# Altium schematic sheet vDAC2.SchDoc: Laser PCB
size A3; DrawnBy: James Singleton; Organization: TMC Technology Ltd.; DocumentNumber: 15; Revision: A; SheetNumber: 15; SheetTotal: 18; Drawn Date: 22/12/2020
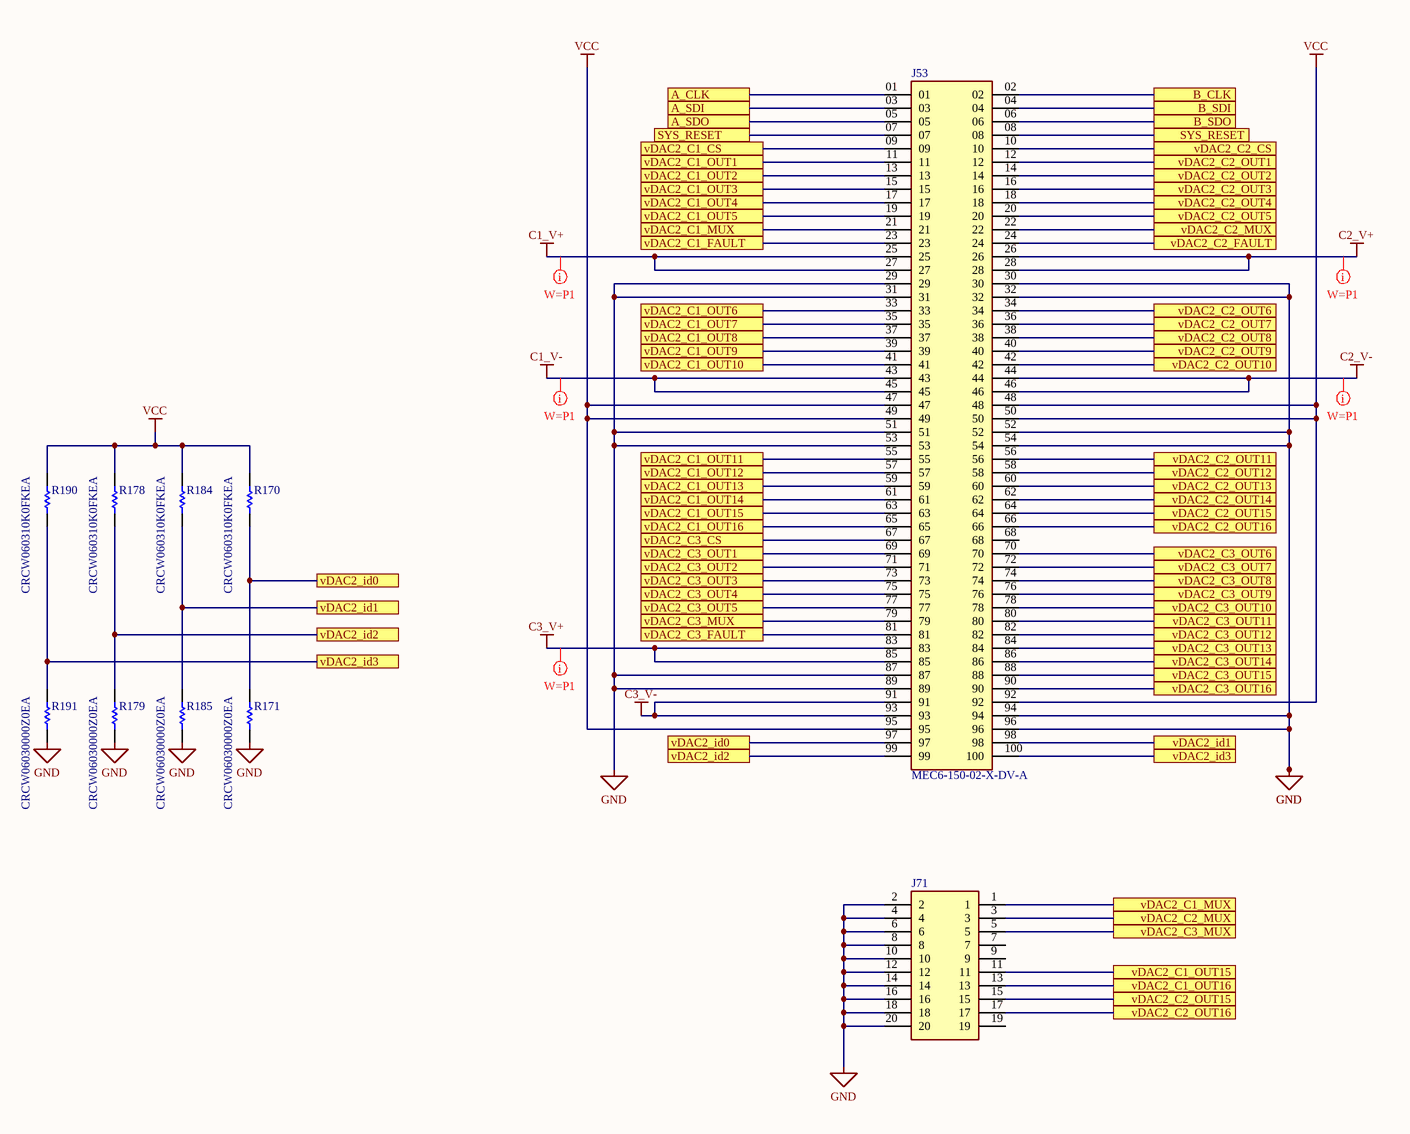
[diagram p0: vDAC2.SchDoc]

## Parts
J53  MEC6-150-02-X-DV-A  [SAMTEC_MEC6-150-02-X-DV-A]
J71  (no value)  [HDRV20W40P127_2X10_1270X340X550P]
R170  CRCW060310K0FKEA  [RESC1609X50X30NL8T20]
R171  CRCW06030000Z0EA  [RESC1609X50X30NL8T20]
R178  CRCW060310K0FKEA  [RESC1609X50X30NL8T20]
R179  CRCW06030000Z0EA  [RESC1609X50X30NL8T20]
R184  CRCW060310K0FKEA  [RESC1609X50X30NL8T20]
R185  CRCW06030000Z0EA  [RESC1609X50X30NL8T20]
R190  CRCW060310K0FKEA  [RESC1609X50X30NL8T20]
R191  CRCW06030000Z0EA  [RESC1609X50X30NL8T20]

## Ports
A_CLK (see iDAC1[4A], iDAC2[4A], PI_INTERFACE[2B], vDAC1[4A]), A_SDI (see iDAC1[4A], iDAC2[4A], PI_INTERFACE[2B], vDAC1[4A]), A_SDO (see iDAC1[4A], iDAC2[4A], PI_INTERFACE[1B], vDAC1[4A]), B_CLK (see iDAC1[6A], iDAC2[6A], PI_INTERFACE[2B], vDAC1[5A]), B_SDI (see iDAC1[6A], iDAC2[6A], PI_INTERFACE[2B], vDAC1[5A]), B_SDO (see iDAC1[6A], iDAC2[6A], PI_INTERFACE[1B], vDAC1[5A]), SYS_RESET (see iDAC1[4A], iDAC1[6A], iDAC2[4A], iDAC2[6A], PI_INTERFACE[1C], PIO[5A], PIO[5D], PIO[7B], PIO[7C], vDAC1[4A], vDAC1[5A], vDAC2[3A]), SYS_RESET (see iDAC1[4A], iDAC1[6A], iDAC2[4A], iDAC2[6A], PI_INTERFACE[1C], PIO[5A], PIO[5D], PIO[7B], PIO[7C], vDAC1[4A], vDAC1[5A], vDAC2[5A]), vDAC2_C1_CS (see ChipSelects+Faults[6A]), vDAC2_C1_FAULT (see ChipSelects+Faults[1A]), vDAC2_C1_MUX (see vDAC2[3B]), vDAC2_C1_MUX (see vDAC2[5C]), vDAC2_C1_OUT1 (see TX_FlexiConnectors[5A]), vDAC2_C1_OUT2 (see TX_FlexiConnectors[5A]), vDAC2_C1_OUT3 (see TX_FlexiConnectors[5A]), vDAC2_C1_OUT4 (see TX_FlexiConnectors[5A]), vDAC2_C1_OUT5 (see TX_FlexiConnectors[5A]), vDAC2_C1_OUT6 (see TX_FlexiConnectors[5B]), vDAC2_C1_OUT7 (see TX_FlexiConnectors[5B]), vDAC2_C1_OUT8 (see TX_FlexiConnectors[5B]), vDAC2_C1_OUT9 (see TX_FlexiConnectors[5B]), vDAC2_C1_OUT10 (see TX_FlexiConnectors[5B]), vDAC2_C1_OUT11 (see TX_FlexiConnectors[5B]), vDAC2_C1_OUT12 (see TX_FlexiConnectors[5B]), vDAC2_C1_OUT13 (see TX_FlexiConnectors[5C]), vDAC2_C1_OUT14 (see TX_FlexiConnectors[5C]), vDAC2_C1_OUT15 (see vDAC2[3B]), vDAC2_C1_OUT15 (see vDAC2[5D]), vDAC2_C1_OUT16 (see vDAC2[3B]), vDAC2_C1_OUT16 (see vDAC2[5D]), vDAC2_C2_CS (see ChipSelects+Faults[6A]), vDAC2_C2_FAULT (see ChipSelects+Faults[1A]), vDAC2_C2_MUX (see vDAC2[5B]), vDAC2_C2_MUX (see vDAC2[5C]), vDAC2_C2_OUT1 (see TX_FlexiConnectors[5A]), vDAC2_C2_OUT2 (see TX_FlexiConnectors[5A]), vDAC2_C2_OUT3 (see TX_FlexiConnectors[5A]), vDAC2_C2_OUT4 (see TX_FlexiConnectors[5A]), vDAC2_C2_OUT5 (see TX_FlexiConnectors[5B]), vDAC2_C2_OUT6 (see TX_FlexiConnectors[5B]), vDAC2_C2_OUT7 (see TX_FlexiConnectors[5B]), vDAC2_C2_OUT8 (see TX_FlexiConnectors[5B]), vDAC2_C2_OUT9 (see TX_FlexiConnectors[5B]), vDAC2_C2_OUT10 (see TX_FlexiConnectors[5B]), vDAC2_C2_OUT11 (see TX_FlexiConnectors[5B]), vDAC2_C2_OUT12 (see TX_FlexiConnectors[5B]), vDAC2_C2_OUT13 (see TX_FlexiConnectors[5C]), vDAC2_C2_OUT14 (see TX_FlexiConnectors[5C]), vDAC2_C2_OUT15 (see vDAC2[5B]), vDAC2_C2_OUT15 (see vDAC2[5D]), vDAC2_C2_OUT16 (see vDAC2[5B]), vDAC2_C2_OUT16 (see vDAC2[5D]), vDAC2_C3_CS (see ChipSelects+Faults[6A]), vDAC2_C3_FAULT (see ChipSelects+Faults[1A]), vDAC2_C3_MUX (see vDAC2[3C]), vDAC2_C3_MUX (see vDAC2[5D]), vDAC2_C3_OUT1 (see RX_FlexiConnectors[2B]), vDAC2_C3_OUT2 (see RX_FlexiConnectors[2B]), vDAC2_C3_OUT3 (see RX_FlexiConnectors[2B]), vDAC2_C3_OUT4 (see RX_FlexiConnectors[2B]), vDAC2_C3_OUT5 (see RX_FlexiConnectors[2B]), vDAC2_C3_OUT6 (see RX_FlexiConnectors[2B]), vDAC2_C3_OUT7 (see RX_FlexiConnectors[2B]), vDAC2_C3_OUT8 (see RX_FlexiConnectors[2B]), vDAC2_C3_OUT9 (see RX_FlexiConnectors[6B]), vDAC2_C3_OUT10 (see RX_FlexiConnectors[6B]), vDAC2_C3_OUT11 (see RX_FlexiConnectors[6B]), vDAC2_C3_OUT12 (see RX_FlexiConnectors[6B]), vDAC2_C3_OUT13 (see RX_FlexiConnectors[6B]), vDAC2_C3_OUT14 (see RX_FlexiConnectors[6B]), vDAC2_C3_OUT15 (see RX_FlexiConnectors[6B]), vDAC2_C3_OUT16 (see RX_FlexiConnectors[6B]), vDAC2_id0 (see ChipSelects+Faults[1C], vDAC2[2C]), vDAC2_id0 (see ChipSelects+Faults[1C], vDAC2[4C]), vDAC2_id1 (see vDAC2[2C]), vDAC2_id1 (see vDAC2[5C]), vDAC2_id2 (see vDAC2[2C]), vDAC2_id2 (see vDAC2[4C]), vDAC2_id3 (see vDAC2[2C]), vDAC2_id3 (see vDAC2[5C])

## Nets
C1_V+: J53.25 J53.27
C1_V-: J53.43 J53.45
C2_V+: J53.26 J53.28
C2_V-: J53.44 J53.46
C3_V+: J53.83 J53.85
C3_V-: J53.91 J53.93
GND: J53.29 J53.30 J53.31 J53.32 J53.51 J53.52 J53.53 J53.54 J53.87 J53.89 J53.94 J53.96 J71.2 J71.4 J71.6 J71.8 J71.10 J71.12 J71.14 J71.16 J71.18 J71.20 R171.1 R179.1 R185.1 R191.1
VCC: J53.47 J53.48 J53.49 J53.50 J53.92 J53.95 R170.2 R178.2 R184.2 R190.2
A_CLK: J53.01 ; port A_CLK
A_SDI: J53.03 ; port A_SDI
A_SDO: J53.05 ; port A_SDO
B_CLK: J53.02 ; port B_CLK
B_SDI: J53.04 ; port B_SDI
B_SDO: J53.06 ; port B_SDO
SYS_RESET: J53.07 J53.08 ; port SYS_RESET
vDAC2_C1_CS: J53.09 ; port vDAC2_C1_CS
vDAC2_C1_FAULT: J53.23 ; port vDAC2_C1_FAULT
vDAC2_C1_MUX: J53.21 J71.1 ; port vDAC2_C1_MUX
vDAC2_C1_OUT1: J53.11 ; port vDAC2_C1_OUT1
vDAC2_C1_OUT2: J53.13 ; port vDAC2_C1_OUT2
vDAC2_C1_OUT3: J53.15 ; port vDAC2_C1_OUT3
vDAC2_C1_OUT4: J53.17 ; port vDAC2_C1_OUT4
vDAC2_C1_OUT5: J53.19 ; port vDAC2_C1_OUT5
vDAC2_C1_OUT6: J53.33 ; port vDAC2_C1_OUT6
vDAC2_C1_OUT7: J53.35 ; port vDAC2_C1_OUT7
vDAC2_C1_OUT8: J53.37 ; port vDAC2_C1_OUT8
vDAC2_C1_OUT9: J53.39 ; port vDAC2_C1_OUT9
vDAC2_C1_OUT10: J53.41 ; port vDAC2_C1_OUT10
vDAC2_C1_OUT11: J53.55 ; port vDAC2_C1_OUT11
vDAC2_C1_OUT12: J53.57 ; port vDAC2_C1_OUT12
vDAC2_C1_OUT13: J53.59 ; port vDAC2_C1_OUT13
vDAC2_C1_OUT14: J53.61 ; port vDAC2_C1_OUT14
vDAC2_C1_OUT15: J53.63 J71.11 ; port vDAC2_C1_OUT15
vDAC2_C1_OUT16: J53.65 J71.13 ; port vDAC2_C1_OUT16
vDAC2_C2_CS: J53.10 ; port vDAC2_C2_CS
vDAC2_C2_FAULT: J53.24 ; port vDAC2_C2_FAULT
vDAC2_C2_MUX: J53.22 J71.3 ; port vDAC2_C2_MUX
vDAC2_C2_OUT1: J53.12 ; port vDAC2_C2_OUT1
vDAC2_C2_OUT2: J53.14 ; port vDAC2_C2_OUT2
vDAC2_C2_OUT3: J53.16 ; port vDAC2_C2_OUT3
vDAC2_C2_OUT4: J53.18 ; port vDAC2_C2_OUT4
vDAC2_C2_OUT5: J53.20 ; port vDAC2_C2_OUT5
vDAC2_C2_OUT6: J53.34 ; port vDAC2_C2_OUT6
vDAC2_C2_OUT7: J53.36 ; port vDAC2_C2_OUT7
vDAC2_C2_OUT8: J53.38 ; port vDAC2_C2_OUT8
vDAC2_C2_OUT9: J53.40 ; port vDAC2_C2_OUT9
vDAC2_C2_OUT10: J53.42 ; port vDAC2_C2_OUT10
vDAC2_C2_OUT11: J53.56 ; port vDAC2_C2_OUT11
vDAC2_C2_OUT12: J53.58 ; port vDAC2_C2_OUT12
vDAC2_C2_OUT13: J53.60 ; port vDAC2_C2_OUT13
vDAC2_C2_OUT14: J53.62 ; port vDAC2_C2_OUT14
vDAC2_C2_OUT15: J53.64 J71.15 ; port vDAC2_C2_OUT15
vDAC2_C2_OUT16: J53.66 J71.17 ; port vDAC2_C2_OUT16
vDAC2_C3_CS: J53.67 ; port vDAC2_C3_CS
vDAC2_C3_FAULT: J53.81 ; port vDAC2_C3_FAULT
vDAC2_C3_MUX: J53.79 J71.5 ; port vDAC2_C3_MUX
vDAC2_C3_OUT1: J53.69 ; port vDAC2_C3_OUT1
vDAC2_C3_OUT2: J53.71 ; port vDAC2_C3_OUT2
vDAC2_C3_OUT3: J53.73 ; port vDAC2_C3_OUT3
vDAC2_C3_OUT4: J53.75 ; port vDAC2_C3_OUT4
vDAC2_C3_OUT5: J53.77 ; port vDAC2_C3_OUT5
vDAC2_C3_OUT6: J53.70 ; port vDAC2_C3_OUT6
vDAC2_C3_OUT7: J53.72 ; port vDAC2_C3_OUT7
vDAC2_C3_OUT8: J53.74 ; port vDAC2_C3_OUT8
vDAC2_C3_OUT9: J53.76 ; port vDAC2_C3_OUT9
vDAC2_C3_OUT10: J53.78 ; port vDAC2_C3_OUT10
vDAC2_C3_OUT11: J53.80 ; port vDAC2_C3_OUT11
vDAC2_C3_OUT12: J53.82 ; port vDAC2_C3_OUT12
vDAC2_C3_OUT13: J53.84 ; port vDAC2_C3_OUT13
vDAC2_C3_OUT14: J53.86 ; port vDAC2_C3_OUT14
vDAC2_C3_OUT15: J53.88 ; port vDAC2_C3_OUT15
vDAC2_C3_OUT16: J53.90 ; port vDAC2_C3_OUT16
vDAC2_id0: J53.97 R170.1 R171.2 ; port vDAC2_id0
vDAC2_id1: J53.98 R184.1 R185.2 ; port vDAC2_id1
vDAC2_id2: J53.99 R178.1 R179.2 ; port vDAC2_id2
vDAC2_id3: J53.100 R190.1 R191.2 ; port vDAC2_id3

Not connected (* = marked no-connect by the designer): J53 68; J71 7 9 19

## Layout directives
mark named W=P1: C1_V+, C1_V-, C2_V+, C2_V-, C3_V+

## Notes on the sheet
- TMC Technology Ltd.
- Page Contents:
- Project:
- Variant:
- Checked By:
- Size:
- Date:
- Dwg No:
- Sheet
- of
- Revision:

## Library data of the parts
J53 = MEC6-150-02-X-DV-A: MF: Samtec; System: Connector; MP: MEC6-150-02-X-DV-A; Package: None; Availability: Unavailable; Value: *; Price: None
J71 = 20021111-00020T4LF: Connector; Manufacturer_Name: FCI Electronics; Datasheet Link: https://media.digikey.com/pdf/Data%20Sheets/FCI%20PDFs/Minitek%20127_Catalog.pdf; Height: 5.5mm; Manufacturer_Part_Number: 20021111-00020T4LF
R170 R178 R184 R190 = CMP-1666-00005-4: Chip Resistor, 10 KOhm, +/- 1%, 100 mW, -55 to 155 degC, 0603 (1608 Metric), RoHS, Tape and Reel; Manufacturer: Vishay Semiconductor; Voltage Rating: 75 V; Max Operating Temperature: 155 degC; PackageDescription: 2-Pin Surface Mount Device, Body 1.575 x 0.85 mm; ComponentLink1Description: Manufacturer URL; RoHSCompliant: true; PackageReference: 0603; REACH SVHC: Unknown; Length: 1.55 mm; DatasheetVersion: 06/2012; Packaging: Tape and Reel; Min Operating Temperature: -55 degC; Mounting Technology: Surface Mount; ComponentLink2URL: https://datasheet.ciiva.com/11809/0900766b80d98afc-11809037.pdf; Height: 0.45 mm; ComponentLink2Description: Datasheet; Package Quantity: 5000; ComponentLink1URL: http://www.vishay.com/
R171 R179 R185 R191 = CMP-2000-03816-5: Chip Resistor, 0 Ohm, Jumper, 100 mW, -55 to 155 degC, 0603 (1608 Metric), RoHS, Tape and Reel; Manufacturer: Vishay Semiconductor; Voltage Rating: 75 V; Package Quantity: 5000; DatasheetVersion: 06/2012; Min Operating Temperature: -55 degC; ComponentLink1URL: http://www.vishay.com/; Mounting Technology: Surface Mount; Height: 0.45 mm; ComponentLink1Description: Manufacturer URL; REACH SVHC: Unknown; PackageReference: 0603; Packaging: Tape and Reel; Max Operating Temperature: 155 degC; Mount: Surface Mount; ComponentLink2Description: Datasheet; PackageDescription: 2-Pin Surface Mount Device, Body 1.575 x 0.85 mm; Length: 1.55 mm; ComponentLink2URL: http://www.vishay.com/docs/20035/dcrcwe3.pdf; Pins: 2; RoHSCompliant: true